# EAGLE design motherboard (EAGLE 4.16)
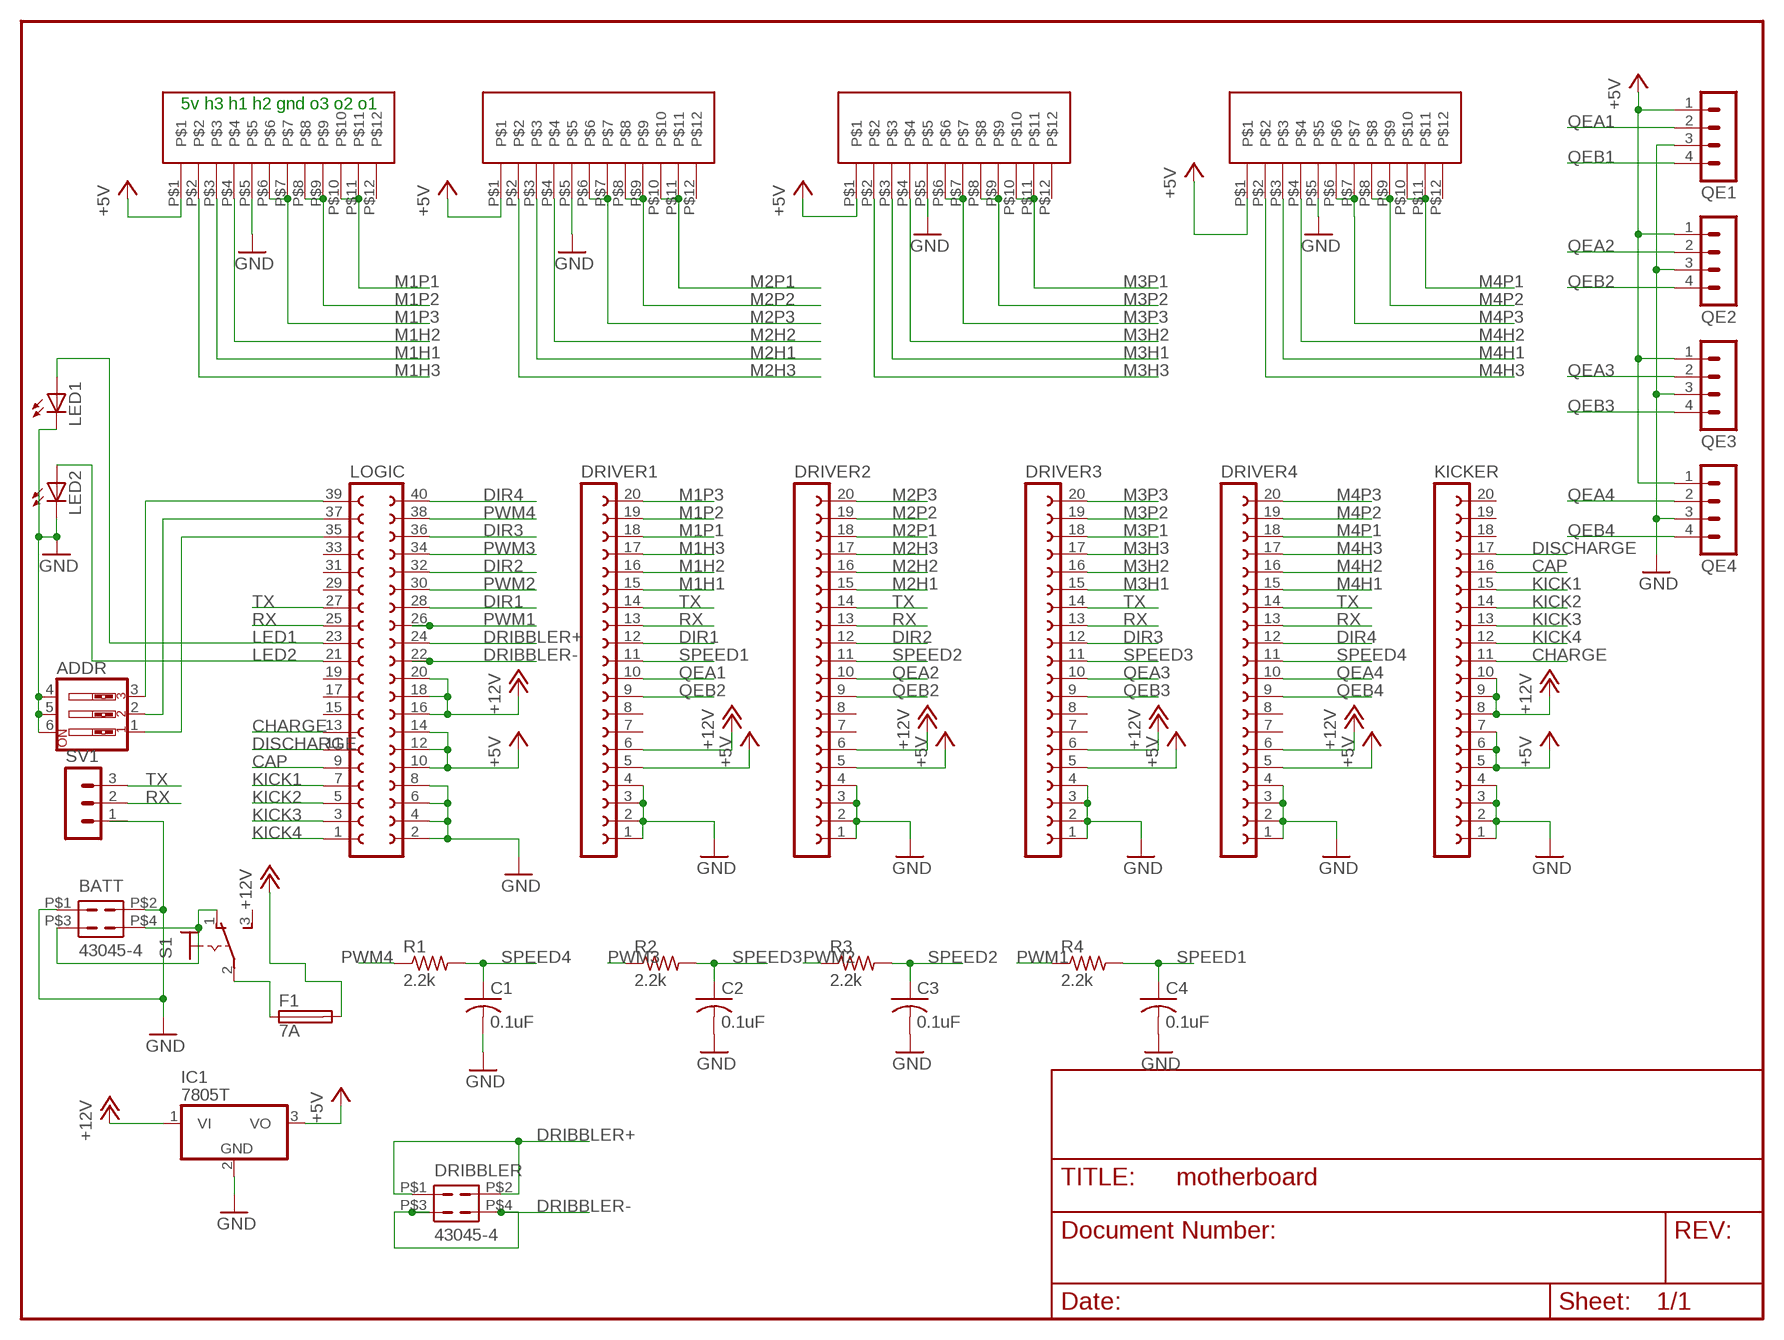
[diagram p0: schematic, sheet 1]

## Parts
ADDR  SW_DIP-3  [EDG-03]
BATT  43045-4  [43045-4]
C1  0.1uF  C-USC1206  [C1206]
C2  0.1uF  C-USC1206  [C1206]
C3  0.1uF  C-USC1206  [C1206]
C4  0.1uF  C-USC1206  [C1206]
DRIBBLER  43045-4  [43045-4]
DRIVER1  FE20-1  [FE20]
DRIVER2  FE20-1  [FE20]
DRIVER3  FE20-1  [FE20]
DRIVER4  FE20-1  [FE20]
F1  7A  FUSEGSH15  [GSH15]
IC1  7805T  [TO220H]
KICKER  FE20-1  [FE20]
LED1  LEDCHIPLED_1206  [CHIPLED_1206]
LED2  LEDCHIPLED_1206  [CHIPLED_1206]
LOGIC  FE20-2  [FE20-2]
QE1  MA04-1  [MA04-1]
QE2  MA04-1  [MA04-1]
QE3  MA04-1  [MA04-1]
QE4  MA04-1  [MA04-1]
R1  2.2k  R-US_R1206  [R1206]
R2  2.2k  R-US_R1206  [R1206]
R3  2.2k  R-US_R1206  [R1206]
R4  2.2k  R-US_R1206  [R1206]
S1  M9040P  [M9040P]
SV1  MA03-1  [MA03-1]
U$1  MOLEX52207-1290  [MOLEX12PINSMT]
U$2  MOLEX52207-1290  [MOLEX12PINSMT]
U$5  MOLEX52207-1290  [MOLEX12PINSMT]
U$8  MOLEX52207-1290  [MOLEX12PINSMT]

## Nets
+5V: DRIVER1.5 DRIVER2.5 DRIVER3.5 DRIVER4.5 IC1.3(VO) KICKER.5 KICKER.6 KICKER.7 LOGIC.10 LOGIC.12 LOGIC.14 QE1.1 QE2.1 QE3.1 QE4.1 U$1.P$1 U$2.P$1 U$5.P$1 U$8.P$1
+12V: DRIVER1.6 DRIVER2.6 DRIVER3.6 DRIVER4.6 F1.2 IC1.1(VI) KICKER.8 KICKER.9 KICKER.10 LOGIC.16 LOGIC.18 LOGIC.20
ADDR1: ADDR.3 LOGIC.39
ADDR2: ADDR.2 LOGIC.37
ADDR3: ADDR.1 LOGIC.35
CAP: KICKER.16 LOGIC.9
CHARGE: KICKER.11 LOGIC.13
DIR1: DRIVER1.12 LOGIC.28
DIR2: DRIVER2.12 LOGIC.32
DIR3: DRIVER3.12 LOGIC.36
DIR4: DRIVER4.12 LOGIC.40
DISCHARGE: KICKER.17 LOGIC.11
DRIBBLER+: DRIBBLER.P$1 DRIBBLER.P$2 LOGIC.24
DRIBBLER-: DRIBBLER.P$3 DRIBBLER.P$4 LOGIC.22
GND: ADDR.4 ADDR.5 ADDR.6 BATT.P$1 BATT.P$2 C1.2 C2.2 C3.2 C4.2 DRIVER1.1 DRIVER1.2 DRIVER1.3 DRIVER1.4 DRIVER2.1 DRIVER2.2 DRIVER2.3 DRIVER2.4 DRIVER3.1 DRIVER3.2 DRIVER3.3 DRIVER3.4 DRIVER4.1 DRIVER4.2 DRIVER4.3 DRIVER4.4 IC1.2(GND) KICKER.1 KICKER.2 KICKER.3 KICKER.4 LED1.C LED2.C LOGIC.2 LOGIC.4 LOGIC.6 LOGIC.8 QE1.3 QE2.3 QE3.3 QE4.3 U$1.P$5 U$2.P$5 U$5.P$5 U$8.P$5
KICK1: KICKER.15 LOGIC.7
KICK2: KICKER.14 LOGIC.5
KICK3: KICKER.13 LOGIC.3
KICK4: KICKER.12 LOGIC.1
LED1: LED1.A LOGIC.23
LED2: LED2.A LOGIC.21
M1H1: DRIVER1.15 U$5.P$3
M1H2: DRIVER1.16 U$5.P$4
M1H3: DRIVER1.17 U$5.P$2
M1P1: DRIVER1.18 U$5.P$10 U$5.P$11
M1P2: DRIVER1.19 U$5.P$8 U$5.P$9
M1P3: DRIVER1.20 U$5.P$6 U$5.P$7
M2H1: DRIVER2.15 U$1.P$3
M2H2: DRIVER2.16 U$1.P$4
M2H3: DRIVER2.17 U$1.P$2
M2P1: DRIVER2.18 U$1.P$10 U$1.P$11
M2P2: DRIVER2.19 U$1.P$8 U$1.P$9
M2P3: DRIVER2.20 U$1.P$6 U$1.P$7
M3H1: DRIVER3.15 U$8.P$3
M3H2: DRIVER3.16 U$8.P$4
M3H3: DRIVER3.17 U$8.P$2
M3P1: DRIVER3.18 U$8.P$10 U$8.P$11
M3P2: DRIVER3.19 U$8.P$8 U$8.P$9
M3P3: DRIVER3.20 U$8.P$6 U$8.P$7
M4H1: DRIVER4.15 U$2.P$3
M4H2: DRIVER4.16 U$2.P$4
M4H3: DRIVER4.17 U$2.P$2
M4P1: DRIVER4.18 U$2.P$10 U$2.P$11
M4P2: DRIVER4.19 U$2.P$8 U$2.P$9
M4P3: DRIVER4.20 U$2.P$6 U$2.P$7
N$2: BATT.P$3 BATT.P$4 S1.1(O)
N$5: F1.1 S1.2(P)
PWM1: LOGIC.26 R4.1
PWM2: LOGIC.30 R3.1
PWM3: LOGIC.34 R2.1
PWM4: LOGIC.38 R1.1
QEA1: DRIVER1.10 QE1.2
QEA2: DRIVER2.10 QE2.2
QEA3: DRIVER3.10 QE3.2
QEA4: DRIVER4.10 QE4.2
QEB1: QE1.4
QEB2: DRIVER1.9 DRIVER2.9 QE2.4
QEB3: DRIVER3.9 QE3.4
QEB4: DRIVER4.9 QE4.4
RX: DRIVER1.13 DRIVER2.13 DRIVER3.13 DRIVER4.13 LOGIC.25 SV1.2
SPEED1: C4.1 DRIVER1.11 R4.2
SPEED2: C3.1 DRIVER2.11 R3.2
SPEED3: C2.1 DRIVER3.11 R2.2
SPEED4: C1.1 DRIVER4.11 R1.2
TX: DRIVER1.14 DRIVER2.14 DRIVER3.14 DRIVER4.14 LOGIC.27 SV1.3
Unconnected: DRIVER1.7 DRIVER1.8 DRIVER2.7 DRIVER2.8 DRIVER3.7 DRIVER3.8 DRIVER4.7 DRIVER4.8 KICKER.18 KICKER.19 KICKER.20 LOGIC.15 LOGIC.17 LOGIC.19 LOGIC.29 LOGIC.31 LOGIC.33 S1.3(S) SV1.1 U$1.P$12 U$2.P$12 U$5.P$12 U$8.P$12

## Notes on the sheet
- 5v h3 h1 h2 gnd o3 o2 o1

## Library data of the parts
ADDR = special:SW_DIP-3: DIP SWITCH
BATT DRIBBLER = con-molex:43045-4
C1-C4 = rcl:C-US: CAPACITOR, American symbol
DRIVER1-DRIVER4 KICKER = con-lsta:FE20-1: FEMALE HEADER
F1 = fuse:FUSE: Fuse
IC1 = linear:78*: Positive VOLTAGE REGULATOR Source: http://cache.national.com/ds/LM/LM78L05.pdf http://www.fairchildsemi.com/ds/LM/LM7805.pdf
LED1 LED2 = led:LED: LED OSRAM: - CHIPLED LG R971, LG N971, LY N971, LG Q971, LY Q971, LO R971, LY R971 LH N974, LH R974 LS Q976, LO Q976, LY Q976 LO Q996 - Hyper CHIPLED LW Q18S LB Q993, LB Q99A, LB R99A - SideLED LS A670, LO A670, LY A670, LG A670, LP A670 LB A673, LV A673, LT A673, LW A673 LH A674 LY A675 LS A676, LA A676, LO A676, LY A676, LW A676 LS A679, LY A679, LG A679 - Hyper Micro SIDELED® LS Y876, LA Y876, LO Y876, LY Y876 LT Y87S - SmartLED LW L88C, LW L88S LB L89C, LB L89S, LG L890 LS L89K, LO L89K, LY L89K LS L896, LA L896, LO L896, LY L896 - TOPLED LS T670, LO T670, LY T670, LG T670, LP T670 LSG T670, LSP T670, LSY T670, LOP T670, LYG T670 LG T671, LOG T671, LSG T671 LB T673, LV T673, LT T673, LW T673 LH T674 LS T676, LA T676, LO T676, LY T676, LB T676, LH T676, LSB T676, LW T676 LB T67C, LV T67C, LT T67C, LS T67K, LO T67K, LY T67K, LW E67C LS E67B, LA E67B, LO E67B, LY E67B, LB E67C, LV E67C, LT E67C LW T67C LS T679, LY T679, LG T679 LS T770, LO T770, LY T770, LG T770, LP T770 LB T773, LV T773, LT T773, LW T773 LH T774 LS E675, LA E675, LY E675, LS T675 LS T776, LA T776, LO T776, LY T776, LB T776 LHGB T686 LT T68C, LB T68C - Hyper Mini TOPLED® LB M676 - Mini TOPLED Santana® LG M470 LS M47K, LO M47K, LY M47K Source: http://www.osram.convergy.de - LUMILED® LXK2-PW12-R00, LXK2-PW12-S00, LXK2-PW14-U00, LXK2-PW14-V00 LXK2-PM12-R00, LXK2-PM12-S00, LXK2-PM14-U00 LXK2-PE12-Q00, LXK2-PE12-R00, LXK2-PE12-S00, LXK2-PE14-T00, LXK2-PE14-U00 LXK2-PB12-K00, LXK2-PB12-L00, LXK2-PB12-M00, LXK2-PB14-N00, LXK2-PB14-P00, LXK2-PB14-Q00 LXK2-PR12-L00, LXK2-PR12-M00, LXK2-PR14-Q00, LXK2-PR14-R00 LXK2-PD12-Q00, LXK2-PD12-R00, LXK2-PD12-S00 LXK2-PH12-R00, LXK2-PH12-S00 LXK2-PL12-P00, LXK2-PL12-Q00, LXK2-PL12-R00 Source: www.luxeon.com
LOGIC = con-lsta:FE20-2: FEMALE HEADER
QE1-QE4 = con-lstb:MA04-1: PIN HEADER
R1-R4 = rcl:R-US_: RESISTOR, American symbol
S1 = switch:M9040P: TOGGLE SWITCH Marquardt
SV1 = con-lstb:MA03-1: PIN HEADER
U$1 U$2 U$5 U$8 = molex:MOLEX52207-1290

## Net classes
1 supply: width 0.508 mm
2 motor: width 0.508 mm

## Board
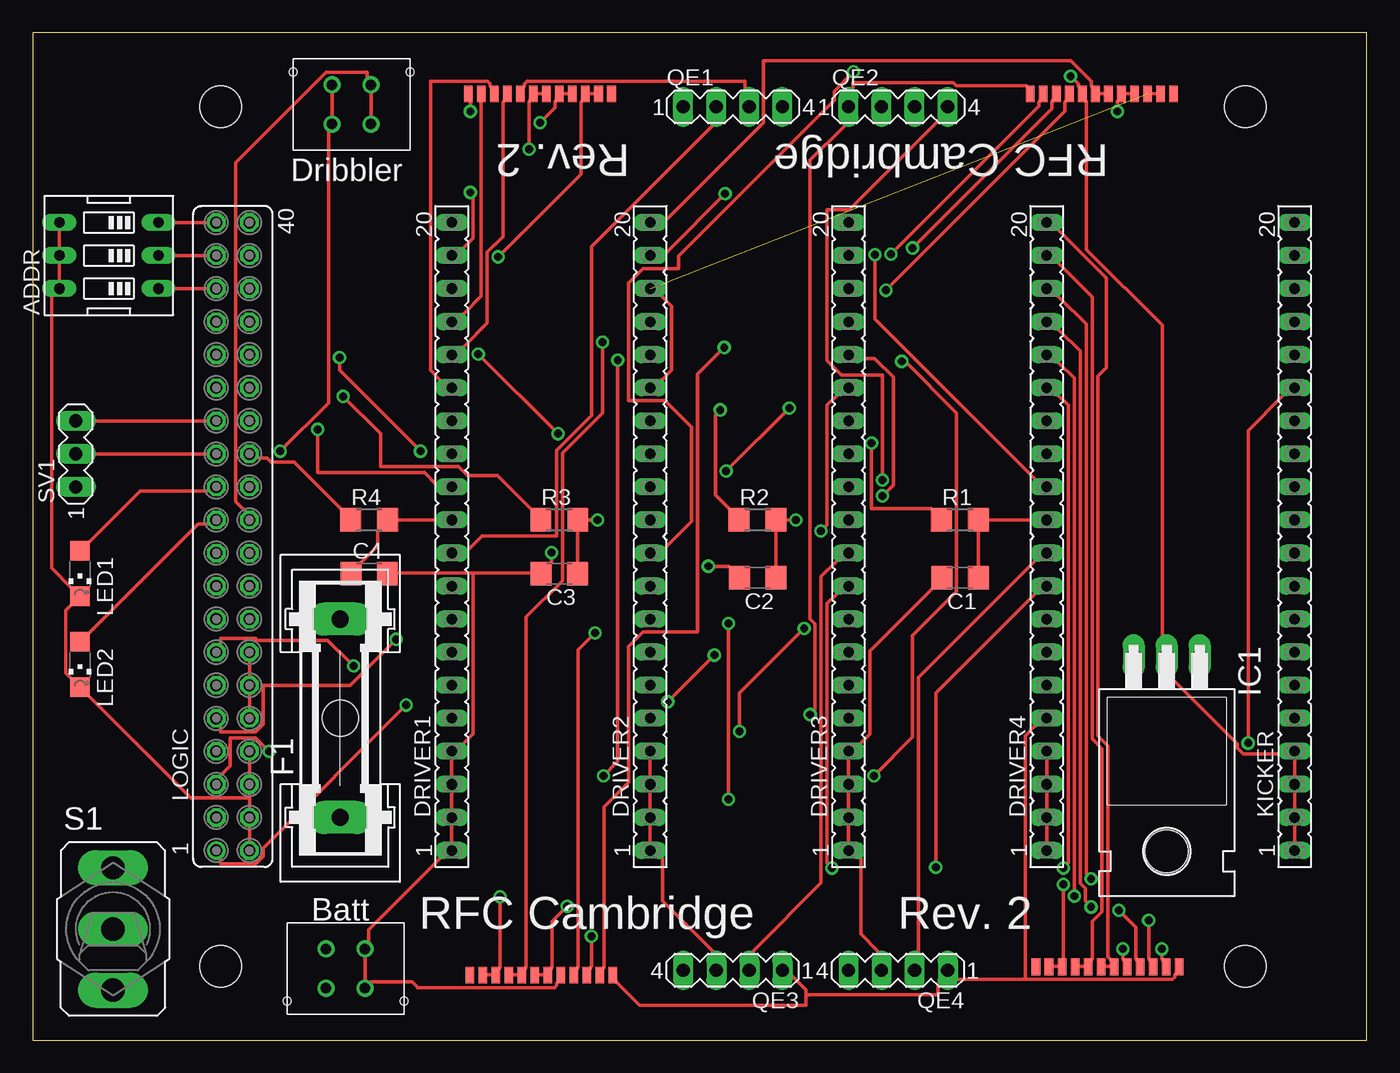
[diagram p1: board, top side]
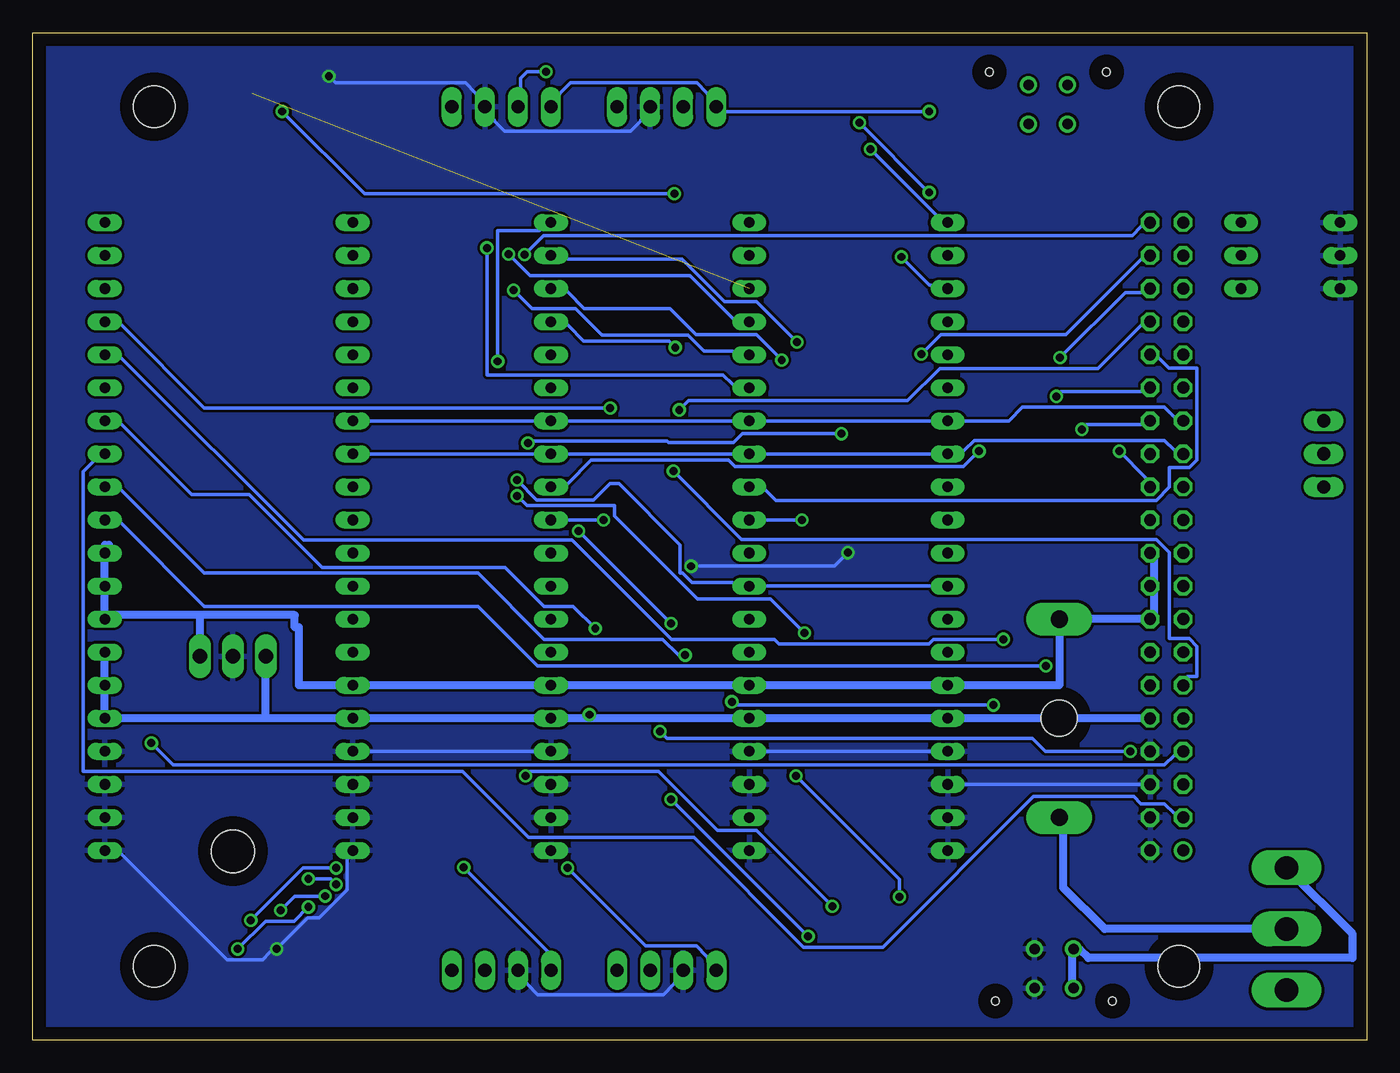
[diagram p2: board, bottom side, seen from below]

Size 102.54 x 77.46 mm. Coordinates in mm from the lower left corner, seen from the top.
Outline: 0,0 102.54,0 102.54,77.46 0,77.46 0,0
Copper layers (1*16): Top 0.035mm / dielectric 1.5mm / Bottom 0.035mm
Design rules "default": minimum track width 10mil, minimum drill 24mil, track to track 8mil, track to pad 8mil, pad to pad 8mil, via to via 8mil, smd to smd 8mil, copper to edge 40mil, drill to drill 8mil, minimum pad ring 10mil, minimum via ring 8mil, stop-mask expansion 4mil, vias tented up to drill 0mil, thermal gap 10mil
Holes 3.2 mm at 14.44,5.71 14.44,71.75 93.18,5.71 93.18,71.75

### Footprints (pad centres in the part's own frame; a part is rotated, then mirrored left to right if it is on the bottom)
EDG-03 = drill 0.813 long: 1 -2.54,-3.81; 2 0,-3.81; 3 2.54,-3.81; 4 2.54,3.81; 5 0,3.81; 6 -2.54,3.81
43045-4 = drill 0.8 round: P$1 0,2; P$2 0,-1; P$3 3,-1; P$4 3,2 | hole 0.6: -3,3; 6,3
C1206 = smd 1.6 x 1.8: 1 -1.4,0; 2 1.4,0
FE20 = drill 0.813 long: 1 -24.13,0; 2 -21.59,0; 3 -19.05,0; 4 -16.51,0; 5 -13.97,0; 6 -11.43,0; 7 -8.89,0; 8 -6.35,0; 9 -3.81,0; 10 -1.27,0; 11 1.27,0; 12 3.81,0; 13 6.35,0; 14 8.89,0; 15 11.43,0; 16 13.97,0; 17 16.51,0; 18 19.05,0; 19 21.59,0; 20 24.13,0
GSH15 = drill 1.321 pad 2.54 long: 1 -7.62,0; 2 7.62,0 | hole 2.794: 0,0
TO220H = drill 1.118 long: 1 -2.54,-10.16; 2 0,-10.16; 3 2.54,-10.16 | hole 3.302: 0,4.826
CHIPLED_1206 = smd 1.5 x 1.5: A 0,-1.75; C 0,1.75
FE20-2 = drill 0.914 round: 1 -24.13,1.27 | drill 0.914 octagon: 2 -24.13,-1.27; 3 -21.59,1.27; 4 -21.59,-1.27; 5 -19.05,1.27; 6 -19.05,-1.27; 7 -16.51,1.27; 8 -16.51,-1.27; 9 -13.97,1.27; 10 -13.97,-1.27; 11 -11.43,1.27; 12 -11.43,-1.27; 13 -8.89,1.27; 14 -8.89,-1.27; 15 -6.35,1.27; 16 -6.35,-1.27; 17 -3.81,1.27; 18 -3.81,-1.27; 19 -1.27,1.27; 20 -1.27,-1.27; 21 1.27,1.27; 22 1.27,-1.27; 23 3.81,1.27; 24 3.81,-1.27; 25 6.35,1.27; 26 6.35,-1.27; 27 8.89,1.27; 28 8.89,-1.27; 29 11.43,1.27; 30 11.43,-1.27; 31 13.97,1.27; 32 13.97,-1.27; 33 16.51,1.27; 34 16.51,-1.27; 35 19.05,1.27; 36 19.05,-1.27; 37 21.59,1.27; 38 21.59,-1.27; 39 24.13,1.27; 40 24.13,-1.27
MA04-1 = drill 1.016 long: 1 -3.81,0; 2 -1.27,0; 3 1.27,0; 4 3.81,0
R1206 = smd 1.6 x 1.803: 1 -1.422,0; 2 1.422,0
M9040P = drill 1.803 long: 1 0,4.699; 2 0,0; 3 0,-4.699
MA03-1 = drill 1.016 long: 1 -2.54,0; 2 0,0; 3 2.54,0
MOLEX12PINSMT = smd 0.66 x 1.27: P$1 0,1; P$2 1,1; P$3 2,1; P$4 3,1; P$5 4,1; P$6 5,1; P$7 6,1; P$8 7,1; P$9 8,1; P$10 9,1; P$11 10,1; P$12 11,1

### Placement (x,y rotation side)
ADDR  5.87,60.32 90 top
BATT  25.55,6.03 180 top
C1  71.27,35.55 180 top
C2  55.71,35.55 180 top
C3  40.48,35.87 180 top
C4  25.87,35.87 0 top
DRIBBLER  23.01,71.43 0 top
DRIVER1  32.22,38.73 90 top
DRIVER2  47.46,38.73 90 top
DRIVER3  62.7,38.73 90 top
DRIVER4  77.94,38.73 90 top
F1  23.65,24.76 90 top
IC1  87.15,19.36 180 top
KICKER  96.99,38.73 90 top
LED1  3.64,35.87 180 top
LED2  3.64,28.89 180 top
LOGIC  15.39,38.73 90 top
QE1  53.81,71.75 0 top
QE2  66.51,71.75 0 top
QE3  53.81,5.39 180 top
QE4  66.51,5.39 180 top
R1  71.27,40 0 top
R2  55.71,40 0 top
R3  40.48,40 0 top
R4  25.87,40 0 top
S1  6.18,8.57 0 top
SV1  3.33,45.08 90 top
U$1  76.67,71.75 0 top
U$2  88.1,6.66 180 top
U$5  33.49,71.75 0 top
U$8  44.6,6.03 180 top

### Tracks (layer width: path | path; a pad name or v marks a point on that pad's centre or on a via)
+5V  (via drill 0.61)
  Top 0.254: U$1.P$1 76.36,73.38 71.01,73.38 70.78,73.6 63.03,73.6 63.03,73.25 QE2.1 62.37,70.25 59.75,67.63 59.75,32.41 60.13,32.02 60.13,25.42 v59.75,25.04 | v33.64,71.39 33.64,72.13 U$5.P$1 | 59.45,3.53 59.45,3.88 58.36,4.97 QE3.1 | 59.45,3.53 59.45,2.69 46.65,2.69 44.92,4.42 U$8.P$1 | LOGIC.14 16.67,29.15 16.67,27.99 LOGIC.12 16.67,26.61 16.67,25.45 LOGIC.10 | 76.29,4.69 71.06,4.69 QE4.1 69.58,4.31 69.58,3.53 59.45,3.53 | 76.29,4.69 87.59,4.69 87.77,4.87 87.77,5.02 87.8,5.05 U$2.P$1 | DRIVER4.5 77,24.12 76.29,23.41 76.29,4.69
  Bottom 0.254: v33.64,71.39 49.26,71.39 QE1.1 50.74,72.84 51.5,73.6 61.2,73.6 61.96,72.84 QE2.1 | 59.75,24.76 v59.75,25.04
  Bottom 0.61: LOGIC.10 DRIVER1.5 | DRIVER1.5 32.22,24.44 | DRIVER1.5 DRIVER2.5 59.75,24.76 DRIVER3.5 DRIVER4.5 84.61,24.76 | 84.61,24.76 IC1.3 | 84.61,24.76 KICKER.5 | KICKER.5 97.31,24.76 97.31,24.44 | KICKER.6 96.99,27.62 | KICKER.5 KICKER.6 | KICKER.6 KICKER.7
+12V
  Bottom 0.61: DRIVER2.6 47.14,27.3 | DRIVER2.6 DRIVER3.6 77.62,27.3 | 77.62,27.3 DRIVER4.6 82.07,27.3 82.07,31.74 82.39,31.74 82.39,32.7 89.69,32.7 | 77.62,27.3 77.62,27.62 | 89.69,32.7 IC1.1 | 89.69,32.7 96.99,32.7 KICKER.8 KICKER.9 KICKER.10 | KICKER.10 96.99,38.1 96.67,38.1 96.67,37.46 KICKER.10 | 32.54,27.3 DRIVER1.6 23.65,27.3 F1.2 | 32.54,27.3 DRIVER2.6 | 32.54,27.3 32.54,27.62 | F1.2 23.65,32.7 | F1.2 LOGIC.16 16.34,32.38 | 16.34,32.38 16.34,32.7 | 16.34,32.38 16.34,34.92 | LOGIC.20 16.34,37.46 16.34,34.92 | 16.34,34.92 LOGIC.18
ADDR1
  Top 0.254: ADDR.3 LOGIC.39
ADDR2
  Top 0.254: ADDR.2 LOGIC.37
ADDR3
  Top 0.254: ADDR.1 LOGIC.35
CAP  (via drill 0.61)
  Top 0.254: v27.93,30.83 24.4,27.3 17.72,27.3 17.72,24.3 17.13,23.72 14.44,23.72 14.44,24.07 LOGIC.9
  Bottom 0.254: v27.93,30.83 33.31,30.83 33.67,30.47 45.17,30.47 45.53,30.83 53.45,30.83 61.07,38.45 81.72,38.45 95.69,52.42 KICKER.16
CHARGE  (via drill 0.61)
  Top 0.254: v24.68,28.77 22.7,30.75 17.23,30.75 17.23,30.78 17.13,30.88 14.44,30.88 14.44,30.53 LOGIC.13
  Bottom 0.254: v24.68,28.77 63.72,28.77 68.31,33.37 89.34,33.37 95.69,39.72 KICKER.11
DIR1  (via drill 0.61)
  Top 0.254: v21.91,46.96 21.91,43.63 30.11,43.63 30.92,42.82 DRIVER1.12
  Bottom 0.254: v21.91,46.96 21.55,47.32 17.36,47.32 LOGIC.28
DIR2
  Bottom 0.254: DRIVER2.12 46.16,42.26 45.4,41.5 16.19,41.5 15.18,42.52 15.18,44.04 13.65,44.04 13.07,44.62 13.07,51.66 15.23,51.66 15.96,52.4 LOGIC.32
DIR3  (via drill 0.61)
  Top 0.254: v29.81,45.28 23.58,51.51 v23.58,52.47
  Bottom 0.254: v29.81,45.28 31,44.09 48.55,44.09 49.06,44.6 59.63,44.6 61.41,42.82 DRIVER3.12 | v23.58,52.47 18.58,57.48 17.36,57.48 LOGIC.36
DIR4  (via drill 0.61)
  Top 0.254: v64.73,60.4 64.73,55.44 77,43.18 DRIVER4.12
  Bottom 0.254: v64.73,60.4 63.26,61.87 18.05,61.87 17.36,62.55 LOGIC.40
DISCHARGE  (via drill 0.61)
  Top 0.254: v53.3,43.76 v58.15,48.61
  Bottom 0.254: v58.15,48.61 89.34,48.61 95.69,54.96 KICKER.17 | v53.3,43.76 48.04,38.5 16.19,38.5 15.18,37.48 15.18,30.88 13.65,30.88 13.07,30.3 13.07,27.99 13.81,27.99 LOGIC.11
DRIBBLER+  (via drill 0.61)
  Top 0.254: DRIBBLER.P$1 23.02,72.79 23.02,71.06 DRIBBLER.P$2 22.75,69.79 22.75,48.99 v19.04,45.28
  Bottom 0.254: v19.04,45.28 16.98,43.23 LOGIC.24
DRIBBLER-
  Top 0.254: DRIBBLER.P$3 26.02,71.06 26.02,72.79 DRIBBLER.P$4 25.72,74.06 25.72,74.42 22.57,74.42 15.61,67.46 15.61,41.42 16.34,40.69 LOGIC.22
GND  (via drill 0.61)
  Top 0.254: ADDR.4 2.07,62.23 2.07,60.96 ADDR.5 2.07,59.69 2.07,58.41 ADDR.6 1.46,57.15 1.46,36.32 2.91,34.87 LED1.C 2.91,33.4 2.55,33.04 2.55,28.24 2.91,27.88 LED2.C 4.38,26.41 12.15,18.64 16.67,18.64 | LOGIC.2 16.67,15.29 16.67,16.45 LOGIC.4 16.67,17.83 16.67,18.64 | LOGIC.8 16.67,21.53 16.67,20.37 LOGIC.6 16.67,18.99 16.67,18.64 | 33.87,35.91 38.29,35.91 C3.2 39.87,36.75 39.87,37.46 v39.89,37.48 | 33.87,35.91 28.05,35.91 C4.2 | v51.93,36.44 53.53,36.44 C2.2 | U$8.P$5 40.3,4.42 40.27,4.39 40.27,4.24 40.09,4.06 29.58,4.06 29.58,4.08 29.17,4.49 26,4.49 BATT.P$1 25.56,4.67 25.56,6.4 BATT.P$2 25.82,7.67 25.82,8.5 31.28,13.97 DRIVER1.1 DRIVER1.2 DRIVER1.3 DRIVER1.4 33.16,22.86 33.87,23.57 33.87,35.91 | v79.77,74.11 80.35,73.53 80.35,73.38 U$1.P$5 80.99,72.13 80.99,60.78 86.8,54.96 86.8,31.19 IC1.2 87.49,27.86 92.57,22.78 92.57,22.5 93.05,22.02 95.69,22.02 KICKER.4 KICKER.3 KICKER.2 KICKER.1 | U$5.P$5 37.81,73.38 37.81,73.53 38.01,73.73 54.75,73.73 54.75,73.25 QE1.3 | DRIVER2.4 DRIVER2.3 DRIVER2.2 DRIVER2.1 48.4,13.97 48.4,10.74 52.23,6.9 QE3.3 | DRIVER4.4 DRIVER4.3 DRIVER4.2 DRIVER4.1 | v83.78,7.03 83.78,6.29 U$2.P$5 | QE4.3 64.94,6.9 63.64,8.2 63.64,13.97 DRIVER3.1 DRIVER3.2 DRIVER3.3 DRIVER3.4 63.64,22.86 64.35,23.57 64.35,29.94 69.08,34.67 C1.2
  Bottom 0.254: v51.93,36.44 51.91,36.47 40.91,36.47 v39.89,37.48 | v79.77,74.11 79.26,73.6 69.28,73.6 68.52,72.84 QE2.3 67.04,70.66 66.28,69.9 56.58,69.9 55.82,70.66 QE1.3 | DRIVER4.1 78.37,13.97 78.37,11.58 80.53,9.42 81.39,9.42 v83.78,7.03 84.27,6.8 84.87,6.19 87.57,6.19 95.69,14.32 KICKER.1 | DRIVER3.4 DRIVER4.4 | QE3.3 53.28,4.31 54.06,3.53 63.72,3.53 64.5,4.31 QE4.3 | DRIVER1.4 DRIVER2.4 | DRIVER1.3 LOGIC.6
  pour Bottom: -3.34,-3.18 105.56,-3.18 105.56,79.69 -3.02,79.69 -3.02,-3.18 -3.02,-2.86 -3.02,-2.54
KICK1  (via drill 0.61)
  Top 0.254: v93.41,22.86 93.41,46.88 96.05,49.53 KICKER.15
  Bottom 0.254: v93.41,22.86 91.73,21.18 15.56,21.18 14.82,21.91 LOGIC.7
KICK2  (via drill 0.61)
  Top 0.254: v59.3,31.67 54.32,26.69 v54.32,23.74 | v18.17,22.22 17.13,23.26 15.18,23.26 15.18,21.1 14.44,20.37 LOGIC.5
  Bottom 0.254: v59.3,31.67 61,33.37 63.23,33.37 66.23,36.37 80.3,36.37 85.89,41.96 90.31,41.96 95.69,47.34 KICKER.14 | v54.32,23.74 53.78,23.21 25.72,23.21 24.73,22.22 v18.17,22.22
KICK3
  Bottom 0.254: KICKER.13 97.93,44.45 98.64,43.73 98.64,20.67 69.51,20.67 64.43,15.59 51.73,15.59 43.29,7.16 37.2,7.16 25.62,18.74 17.92,18.74 17.36,18.18 15.56,18.18 14.82,17.45 LOGIC.3
KICK4  (via drill 0.61)
  Top 0.254: v48.81,26.03 v52.39,29.61 | v28.71,25.78 17.72,14.78 17.72,14.14 17.13,13.56 14.44,13.56 14.44,13.91 LOGIC.1
  Bottom 0.254: v52.39,29.61 52.9,29.61 54.12,30.83 63.23,30.83 68.31,35.91 89.34,35.91 95.69,42.26 KICKER.12 | v48.81,26.03 48.55,25.78 v28.71,25.78
LED1
  Top 0.254: LED1.A 4.38,38.35 8.27,42.23 13.42,42.23 LOGIC.23
LED2
  Top 0.254: LED2.A 4.38,31.36 12.71,39.7 13.42,39.7 LOGIC.21
M1H1
  Top 0.254: U$5.P$3 35.17,73.38 35.17,73.53 34.96,73.73 30.57,73.73 30.57,51.51 31.28,50.8 DRIVER1.15
M1H2
  Top 0.254: U$5.P$4 36.18,72.13 36.16,72.11 36.16,61.79 34.94,60.57 34.94,55.11 33.16,53.34 DRIVER1.16
M1H3
  Top 0.254: U$5.P$2 34.48,72.13 34.48,57.2 33.16,55.88 DRIVER1.17
M1P1  (via drill 0.61)
  Top 0.254: U$5.P$11 43.17,72.77 42.81,72.77 U$5.P$10 42.18,72.13 42.15,72.11 42.15,66.59 v35.78,60.22
  Bottom 0.254: v35.78,60.22 33.62,58.06 33.52,58.06 DRIVER1.18
M1P2  (via drill 0.61)
  Top 0.254: U$5.P$9 41.16,72.77 40.8,72.77 U$5.P$8 40.17,72.13 40.17,71.7 v39,70.53 | v33.64,65.17 33.87,64.94 33.87,61.67 33.16,60.96 DRIVER1.19
  Bottom 0.254: v33.64,65.17 v39,70.53
M1P3  (via drill 0.61)
  Top 0.254: U$5.P$7 39.18,72.77 38.8,72.77 U$5.P$6 38.16,72.13 v38.16,68.5
  Bottom 0.254: v38.16,68.5 33.16,63.5 DRIVER1.20
M2H1  (via drill 0.61)
  Top 0.254: v67.63,60.9 78.35,71.62 78.35,72.13 U$1.P$3 | 48.4,57.15 49.11,56.43 49.11,51.51 48.4,50.8 DRIVER2.15
  Bottom 0.254: v67.63,60.9 67.63,51.15 49.47,51.15 48.75,50.44 DRIVER2.15
M2H2  (via drill 0.61)
  Top 0.254: v65.57,57.65 79.34,71.42 79.34,72.11 79.36,72.13 U$1.P$4
  Bottom 0.254: v65.57,57.65 64.15,56.23 60.8,56.23 58.76,54.2 52.16,54.2 50.94,52.98 48.75,52.98 DRIVER2.16
M2H3  (via drill 0.61)
  Top 0.254: v65.95,60.42 77.33,71.8 77.33,72.11 77.36,72.13 U$1.P$2
  Bottom 0.254: v65.95,60.42 64.3,58.77 52.01,58.77 48.75,55.52 DRIVER2.17
M2P1  (1 unrouted)
  Top 0.254: U$1.P$10 85.99,72.77 86.35,72.77 U$1.P$11
M2P2  (via drill 0.61)
  Top 0.254: U$1.P$9 84.34,72.77 83.98,72.77 U$1.P$8 83.35,72.13 v83.35,71.39 | v53.23,65.07 48.75,60.6 DRIVER2.19
  Bottom 0.254: v83.35,71.39 77.03,65.07 v53.23,65.07
M2P3
  Top 0.254: U$1.P$7 82.36,72.77 81.98,72.77 U$1.P$6 81.34,73.38 81.34,73.73 79.79,75.28 56.17,75.28 56.17,70.53 48.75,63.11 DRIVER2.20
M3H1  (via drill 0.61)
  Top 0.254: v42.94,8 42.94,5.68 42.91,5.66 U$8.P$3 | v53.48,18.54 v53.48,32.05 | v60.59,39.16 61.05,39.62 61.05,48.81 61.76,49.53 DRIVER3.15
  Bottom 0.254: v42.94,8 v53.48,18.54 | v53.48,32.05 v60.59,39.16
M3H2  (via drill 0.61)
  Top 0.254: v43.22,31.31 41.92,30.02 41.92,5.66 U$8.P$4 | v65.32,41.85 66.15,42.69 66.15,50.97 64.71,52.42 63.99,52.42 DRIVER3.16
  Bottom 0.254: v43.22,31.31 45.83,33.93 51.45,33.93 57.82,40.3 57.82,41.09 64.55,41.09 v65.32,41.85
M3H3  (via drill 0.61)
  Top 0.254: v53.15,53.26 51.09,51.2 51.09,31.39 46.93,31.39 45.81,30.27 45.81,19.83 43.93,17.95 43.93,5.66 U$8.P$2
  Bottom 0.254: v53.15,53.26 53.63,53.74 60.19,53.74 61.41,54.96 DRIVER3.17
M3P1  (via drill 0.61)
  Top 0.254: U$8.P$11 34.91,5.05 35.29,5.05 U$8.P$10 35.93,5.66 v35.93,11.04 | v43.88,20.34 44.97,21.43 v44.97,52.29
  Bottom 0.254: v35.93,11.04 35.93,12.39 v43.88,20.34 | v44.97,52.29 46.93,54.25 51.55,54.25 53.56,56.26 60.16,56.26 61.41,57.5 DRIVER3.18
M3P2  (via drill 0.61)
  Top 0.254: U$8.P$9 36.92,5.05 37.27,5.05 U$8.P$8 37.91,5.66 37.94,5.68 37.94,32.53 40.73,35.33 40.73,45.13 43.8,48.2 v43.8,53.66
  Bottom 0.254: v43.8,53.66 46.93,56.79 49.37,56.79 52.62,60.04 61.41,60.04 DRIVER3.19
M3P3  (via drill 0.61)
  Top 0.254: U$8.P$7 38.93,5.05 39.28,5.05 U$8.P$6 39.92,5.66 39.92,9.14 v41.09,10.31 | v64.66,20.34 67.63,23.31 67.63,31.11 71.01,34.49 71.01,48.2 67.02,52.19 v66.79,52.19
  Bottom 0.254: v41.09,10.31 46.93,16.15 49.9,16.15 54.42,20.67 64.33,20.67 v64.66,20.34 | v66.79,52.19 66.79,62.23 63.64,62.23 DRIVER3.20
M4H1  (via drill 0.61)
  Top 0.254: v85.76,9.24 85.76,6.32 85.79,6.29 U$2.P$3 | v79.21,13.25 79.59,13.64 79.59,48.81 78.88,49.53 DRIVER4.15
  Bottom 0.254: v85.76,9.24 81.75,13.25 v79.21,13.25
M4H2  (via drill 0.61)
  Top 0.254: v83.48,10 84.77,8.71 84.77,6.29 U$2.P$4 | v80.05,11.1 80.05,50.9 78.88,52.07 DRIVER4.16
  Bottom 0.254: v83.48,10 82.39,11.1 v80.05,11.1
M4H3  (via drill 0.61)
  Top 0.254: v86.78,7.03 86.78,6.29 U$2.P$2 | v81.34,10.26 80.89,10.71 80.89,11.68 80.5,12.06 80.5,52.98 78.88,54.61 DRIVER4.17
  Bottom 0.254: v86.78,7.03 84.65,9.16 82.44,9.16 v81.34,10.26
M4P1  (via drill 0.61)
  Top 0.254: U$2.P$11 78.42,5.68 78.78,5.68 U$2.P$10 79.21,6.29 v79.21,11.98 | v81.34,12.42 80.96,12.8 80.96,55.06 78.88,57.15 DRIVER4.18
  Bottom 0.254: v79.21,11.98 79.64,12.42 v81.34,12.42
M4P2
  Top 0.254: U$2.P$9 80.43,5.68 80.78,5.68 U$2.P$8 81.42,6.29 81.42,9.14 82.18,9.9 82.18,22.42 81.42,23.18 81.42,57.15 78.88,59.69 DRIVER4.19
M4P3
  Top 0.254: U$2.P$7 82.41,5.68 82.79,5.68 U$2.P$6 82.79,6.29 82.64,6.45 82.64,22.63 81.88,23.39 81.88,51.07 82.51,51.71 82.51,58.59 78.88,62.23 DRIVER4.20
N$2
  Bottom 0.61: S1.1 1.1,8.19 1.1,6.34 21.42,6.34 22.06,6.98 22.6,6.98 | 22.6,6.98 22.7,6.98 | 22.6,6.98 BATT.P$3 22.7,6.88 22.7,3.88 | 22.7,3.88 22.7,3.8 | 22.7,3.88 BATT.P$4
N$5
  Bottom 0.61: F1.1 23.33,17.14 23.33,11.74 20.15,8.57 S1.2
PWM1
  Top 0.254: R4.1 23.66,40.89 20.1,44.45 18.35,44.45 18.02,44.78 17.36,44.78 LOGIC.26
PWM2  (via drill 0.61)
  Top 0.254: v23.86,49.5 26.73,46.63 26.73,44.09 32.75,44.09 33.44,43.4 35.75,43.4 38.27,40.89 R3.1
  Bottom 0.254: v23.86,49.5 23.51,49.86 17.36,49.86 LOGIC.30
PWM3  (via drill 0.61)
  Top 0.254: v52.84,48.46 52.46,48.08 52.46,41.93 53.5,40.89 R2.1
  Bottom 0.254: v52.84,48.46 52.13,49.17 35.29,49.17 32.83,51.63 20.66,51.63 17.36,54.94 LOGIC.34
PWM4  (via drill 0.61)
  Top 0.254: v64.48,45.92 64.48,40.89 69.08,40.89 R1.1 | v34.25,52.75 v40.37,46.63
  Bottom 0.254: v64.48,45.92 64.33,46.07 53.78,46.07 53.66,45.94 48.68,45.94 47.99,46.63 v40.37,46.63 | v34.25,52.75 32.75,54.25 23.13,54.25 17.36,60.02 LOGIC.38
QEA1
  Top 0.254: DRIVER1.10 33.52,37.74 34.53,38.76 40.27,38.76 40.27,45.33 42.96,48.03 42.96,61.01 52.21,70.25 QE1.2
QEA2  (via drill 0.61)
  Top 0.254: v63.08,74.44 61.61,72.97 61.61,72.26 49.62,60.27 49.62,59.33 46.93,59.33 45.81,58.21 45.81,49.17 48.6,49.17 50.63,47.14 50.63,39.87 48.63,37.87 DRIVER2.10
  Bottom 0.254: v63.08,74.44 64.55,74.44 65.04,73.96 65.04,73.25 QE2.2
QEA3
  Top 0.254: DRIVER3.10 61.76,36.83 60.59,35.66 60.59,12.11 55.38,6.9 QE3.2
QEA4
  Top 0.254: DRIVER4.10 77,36.83 68.08,27.91 68.08,6.9 QE4.2
QEB2  (via drill 0.61)
  Top 0.254: v65.32,43.07 65.32,51.15 62.17,51.15 61.05,52.27 61.05,63.85 62.78,63.85 69.58,70.66 QE2.4
  Bottom 0.254: DRIVER1.9 DRIVER2.9 48.75,35.2 51.88,35.2 52.59,35.91 52.77,35.91 52.77,38.1 57.47,42.79 58.18,42.79 59.42,41.55 63.79,41.55 v65.32,43.07
QEB3  (via drill 0.61)
  Top 0.254: v61.43,13.25 61.05,13.64 61.05,33.57 61.76,34.29 DRIVER3.9
  Bottom 0.254: v61.43,13.25 55.44,7.26 51.52,7.26 50.74,6.47 QE3.4
QEB4  (via drill 0.61)
  Top 0.254: v69.41,13.31 69.41,26.69 77,34.29 DRIVER4.9
  Bottom 0.254: v69.41,13.31 63,6.9 QE4.4
RX
  Top 0.254: SV1.2 LOGIC.25
  Bottom 0.254: DRIVER4.13 DRIVER3.13 DRIVER2.13 DRIVER1.13 30.92,45.36 30.16,46.12 15.56,46.12 14.82,45.39 LOGIC.25
SPEED1
  Top 0.254: C4.1 25.26,36.75 26.5,37.99 26.5,39.11 R4.2 DRIVER1.11
SPEED2  (via drill 0.61)
  Top 0.254: C3.1 41.87,36.75 41.87,39.11 R3.2 v43.42,40
  Bottom 0.254: v43.42,40 DRIVER2.11
SPEED3  (via drill 0.61)
  Top 0.254: C2.1 57.11,36.44 57.11,39.11 R2.2 v58.66,40
  Bottom 0.254: v58.66,40 DRIVER3.11
SPEED4
  Top 0.254: C1.1 72.68,36.44 72.68,39.11 R1.2 DRIVER4.11
TX
  Top 0.254: SV1.3 LOGIC.27
  Bottom 0.254: DRIVER4.14 DRIVER3.14 DRIVER2.14 DRIVER1.14 27.52,47.62 26.48,48.66 15.56,48.66 14.82,47.93 LOGIC.27

### Text on the board
tPlace: Dribbler | Batt
tNames: RFC Cambridge Rev. 2 | RFC Cambridge Rev. 2